# EAGLE design 225_gps (EAGLE 9.6.2)
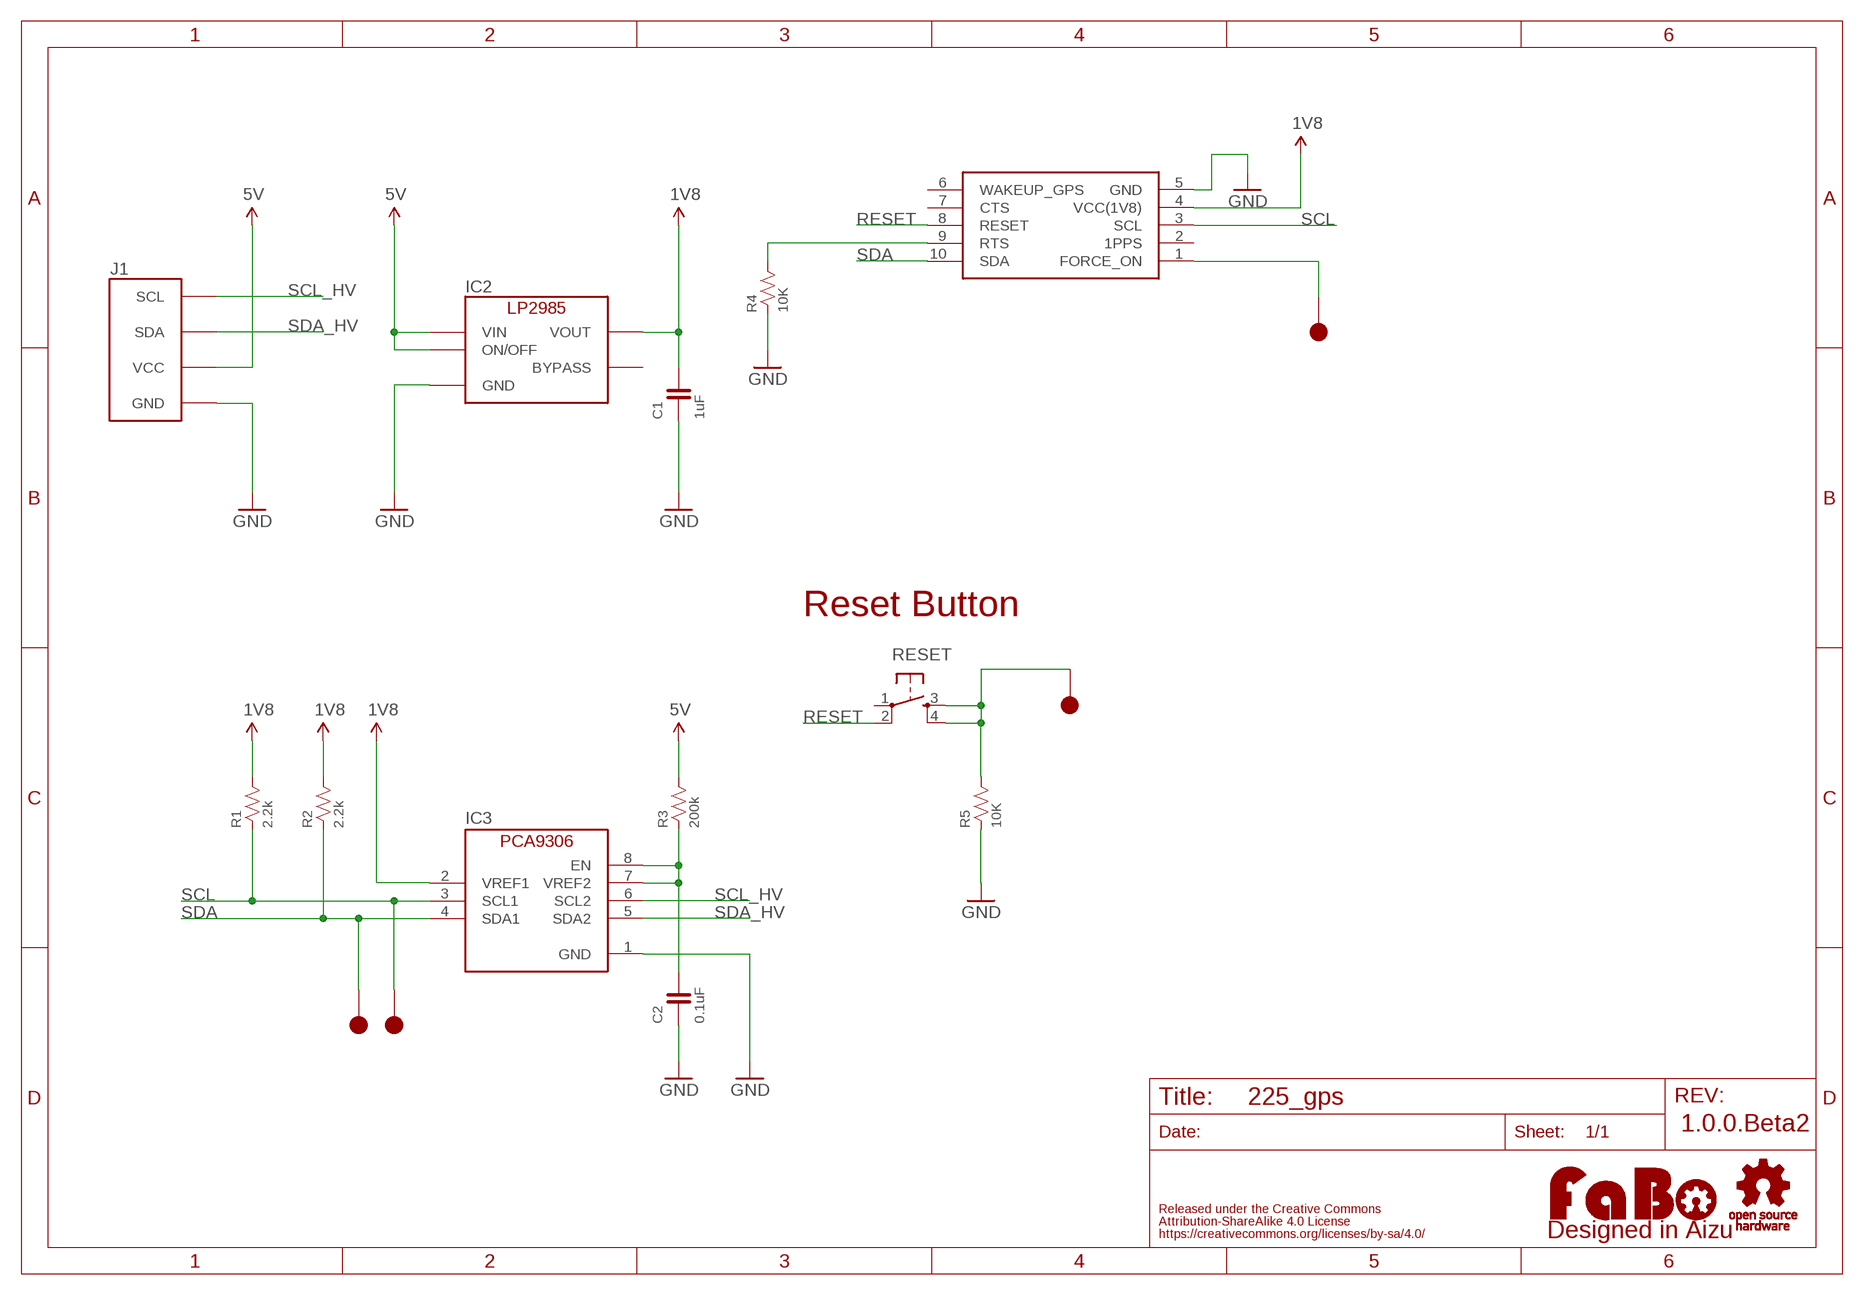
[diagram p0: schematic, sheet 1]

## Parts
C1  1uF  CAPACITOR-0603  [0603]
C2  0.1uF  CAPACITOR-0603  [0603]
IC2  LP2985-33DBV  [SOT-23-5]
IC3  PCA9306GM  [XQFN8]
J1  FABO_BRICK_I2C  [FABO_BRICK_I2C]
LOGO1  LOGO_FABO-M  [LOGO_FABO_M]
R1  2.2k  RESISTOR-0603  [0603]
R2  2.2k  RESISTOR-0603  [0603]
R3  200k  RESISTOR-0603  [0603]
R4  10K  RESISTOR-0603  [0603]
R5  10K  RESISTOR-0603  [0603]
RESET  TACT-SWITCH-SMD_KMR2  [KMR2]
TP1  TP-15  [TP-15]
TP2  TP-15  [TP-15]
TP3  TP-15  [TP-15]
TP4  TP-15  [TP-15]
U$2  LOGO_OSHW-M_BOTTOM  [LOGO_OSHW_M_BOTTOM]
U$4  ORIGINGPS_ORG1510  [ORIGINGPS_ORG1510]

## Nets
1V8: C1.2 IC2.5(VOUT) IC3.2(VREF1) R1.2 R2.2 U$4.4(VCC(1V8))
5V: IC2.1(VIN) IC2.3(ON/OFF) J1.VCC R3.2
GND: C1.1 C2.1 IC2.2(GND) IC3.1(GND) J1.GND R4.1 R5.1 U$4.5(GND)
N$1: C2.2 IC3.7(VREF2) IC3.8(EN) R3.1
N$2: R4.2 U$4.9(RTS)
N$4: TP3.1 U$4.1(FORCE_ON)
N$5: R5.2 RESET.3 RESET.4 TP4.1
RESET: RESET.2 U$4.8(RESET)
SCL: IC3.3(SCL1) R1.1 TP2.1 U$4.3(SCL)
SCL_HV: IC3.6(SCL2) J1.SCL
SDA: IC3.4(SDA1) R2.1 TP1.1 U$4.10(SDA)
SDA_HV: IC3.5(SDA2) J1.SDA
Unconnected: IC2.4(BYPASS) RESET.1 U$4.2(1PPS) U$4.6(WAKEUP_GPS) U$4.7(CTS)

## Notes on the sheet
- Reset Button
- 1.0.0.Beta2

## Library data of the parts
C1 C2 = FaBo-Capacitor:CAPACITOR: CAPACITOR
IC2 = FaBo-Supply:LP2985: LP2985
IC3 = FaBo-LevelTranslator:PCA9306
J1 = FaBo-Template:FABO_BRICK_I2C: FaBo Brick I2C
LOGO1 = component:LOGO_FABO
R1-R5 = FaBo-Resistors:RESISTOR: RESISTOR
RESET = FaBo-Switch:TACT-SWITCH
TP1-TP4 = FaBo-Supply:TP
U$2 = FaBo-etc:LOGO_OSHW
U$4 = FaBo-GPS:ORIGINGPS_ORG1510

## Board
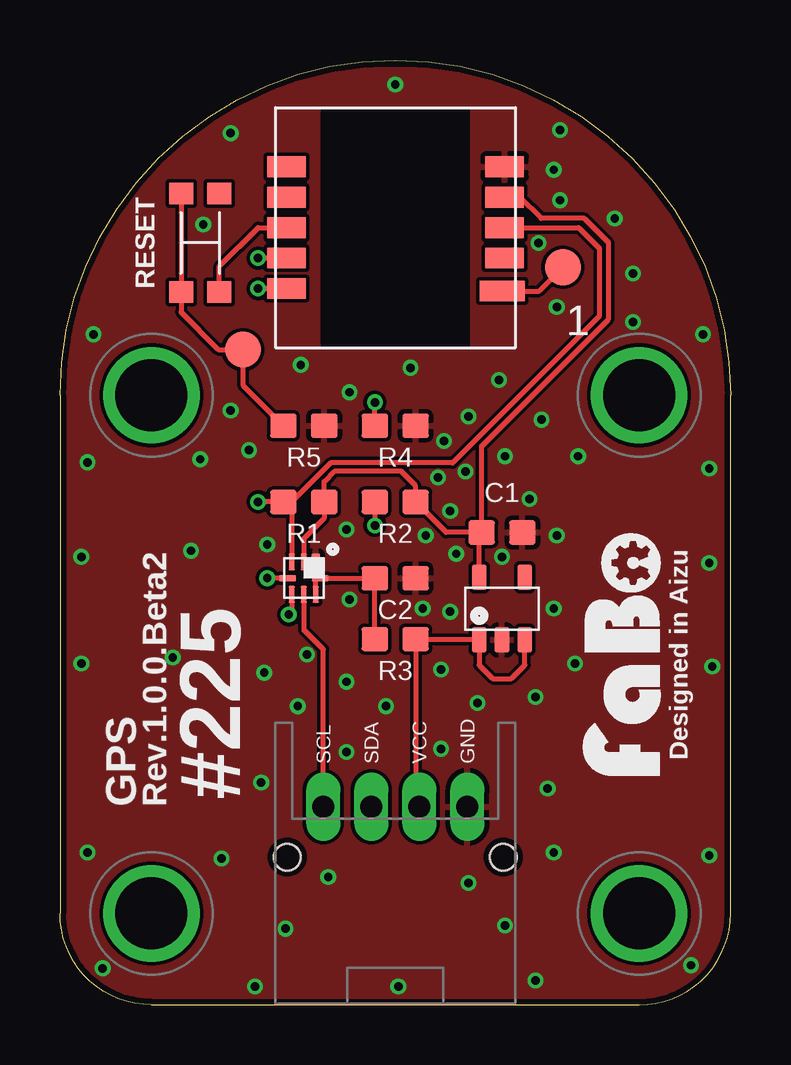
[diagram p1: board, top side]
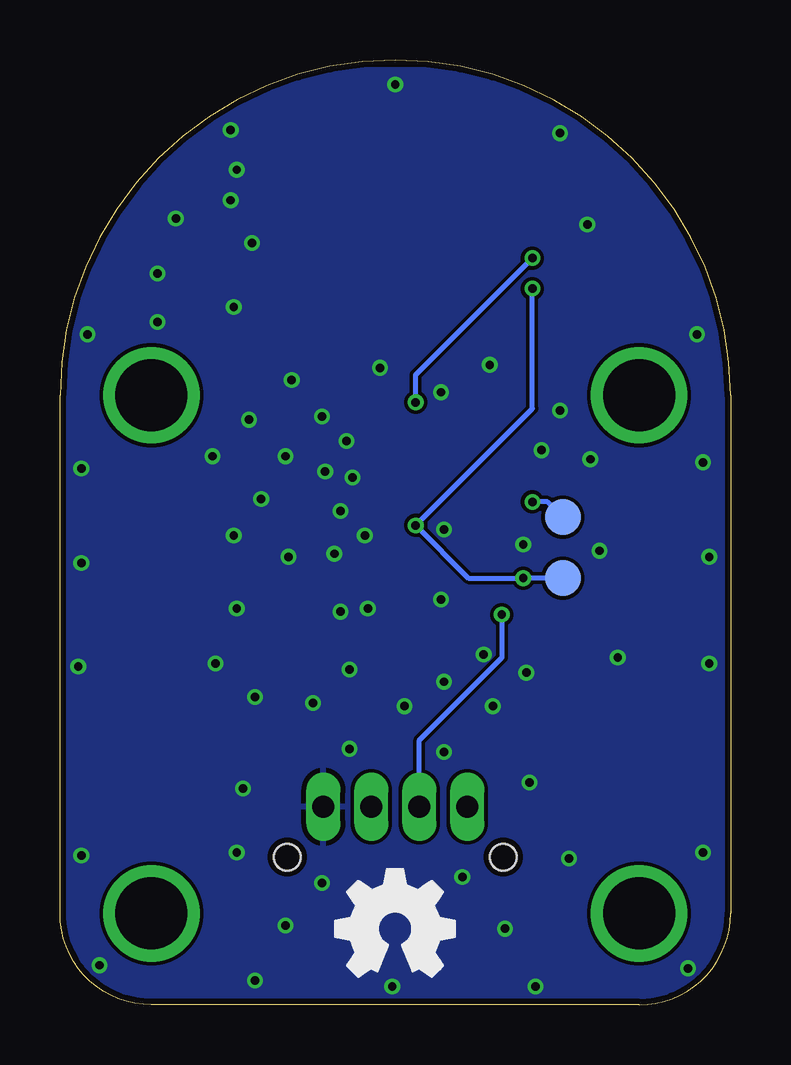
[diagram p2: board, bottom side, seen from below]

Size 27.94 x 39.37 mm. Coordinates in mm from the lower left corner, seen from the top.
Copper layers (1*16): Top 0.035mm / dielectric 1.6mm / Bottom 0.035mm
Design rules "PCBway": minimum track width 6mil, minimum drill 12mil, track to track 6mil, track to pad 6mil, pad to pad 6mil, via to via 6mil, smd to smd 6mil, copper to edge 10mil, drill to drill 10mil, minimum pad ring 10mil, minimum via ring 6mil, stop-mask expansion 2mil, vias tented up to drill 100mil, thermal gap 8mil

### Footprints (pad centres in the part's own frame; a part is rotated, then mirrored left to right if it is on the bottom)
0603 = smd 1.1 x 1: 1 -0.85,0; 2 0.85,0
SOT-23-5 = smd 0.6 x 1.05: 1 -0.95,-1.3; 2 0,-1.3; 3 0.95,-1.3; 4 0.95,1.3; 5 -0.95,1.3
XQFN8 = smd 0.7 x 0.35: 1 -0.675,0.5 | smd 0.7 x 0.25: 2 -0.675,0; 3 -0.675,-0.5; 5 0.675,-0.5; 6 0.675,0; 7 0.675,0.5 | smd 0.25 x 0.7: 4 0,-0.675; 8 0,0.675
FABO_BRICK_I2C = drill 0.9 pad 1.422 long: GND 3,-10.795; SCL -3,-10.795; SDA -1,-10.795; VCC 1,-10.795 | drill 3 pad 3.81: P$1 -10.16,6.35; P$2 10.16,6.35; P$3 -10.16,-15.24; P$4 10.16,-15.24 | hole 1.1: -4.5,-12.895; 4.5,-12.895
KMR2 = smd 0.9 x 1: 1 -2.05,0.8; 2 2.05,0.8; 3 2.05,-0.8; 4 -2.05,-0.8
TP-15 = smd 1.5 x 1.5: 1 0,0
ORIGINGPS_ORG1510 = smd 1.874 x 0.864: 1 4.454,-2.64 | smd 1.6 x 0.864: 2 4.554,-1.27; 3 4.554,0; 4 4.554,1.27; 5 4.554,2.54; 6 -4.536,2.54; 7 -4.536,1.27; 8 -4.536,0; 9 -4.536,-1.27; 10 -4.536,-2.54

### Placement (x,y rotation side)
C1  18.41,19.68 180 top
C2  13.97,17.78 180 top
IC2  18.41,16.51 0 top
IC3  10.16,17.78 270 top
J1  13.97,19.05 0 top
LOGO1  25.4,14.61 90 top
R1  10.16,20.95 0 top
R2  13.97,20.95 0 top
R3  13.97,15.24 0 top
R4  13.97,24.13 180 top
R5  10.16,24.13 180 top
RESET  5.84,31.75 270 top
TP1  6.99,17.78 0 bottom
TP2  6.99,20.32 0 bottom
TP3  20.95,30.73 0 top
TP4  7.62,27.3 0 top
U$2  13.97,3.17 0 top
U$4  13.97,32.38 0 top

### Tracks (layer width: path | path; a pad name or v marks a point on that pad's centre or on a via)
1V8
  Top 0.203: U$4.4 19.16,33.66 20.05,32.77 21.84,32.77 22.86,31.75 22.86,28.57 17.57,23.28 C1.2 | IC3.2 10.16,19.43 11.01,20.28 R1.2 11.01,21.8 11.43,22.23 14.22,22.23 14.82,21.63 R2.2 16.09,19.68 C1.2 | IC2.5 17.46,19.59 C1.2
5V
  Top 0.203: J1.VCC 14.82,8.4 R3.2 17.43,15.24 IC2.1 17.46,14.16 18.03,13.59 18.8,13.59 19.36,14.16 IC2.3
GND  (via drill 0.35)
  other vias: 19.94,31.75 10.29,14.61 12.06,16.89 16.26,20.57 16.89,22.23 15.75,21.97 16,23.5 11.94,19.81 15.24,19.56 16.51,18.8 18.41,18.67 15.11,16.51 16.26,16.38 20.57,16.51 20.7,19.56 19.56,21.08 18.54,22.86 17.02,24.51 18.29,26.04 20.07,24.38 20.7,29.08 23.88,28.45 23.88,30.48 23.11,32.77 20.83,33.53 20.57,34.8 13.97,38.35 7.11,36.32 20.83,36.45 26.8,27.94 1.4,27.94 5.97,32.51 10.03,26.67 14.61,26.54 7.11,24.77 1.14,22.61 27.05,22.35 7.87,23.11 21.59,22.86 5.84,22.73 8.64,19.18 5.46,18.92 0.89,18.67 27.05,18.41 21.46,14.22 27.18,14.1 0.89,14.22 4.7,14.48 8.51,13.84 9.91,12.45 11.94,13.46 15.88,13.97 19.81,12.83 12.06,25.53 1.14,6.35 27.05,6.22 20.57,6.35 6.73,6.1 1.78,1.52 26.29,1.65 14.1,0.76 8.13,0.76 19.81,1.02 17.02,5.08 11.18,5.33 8.38,9.27 20.32,9.02 15.88,10.67 17.4,12.57 13.59,12.45 11.94,10.54 9.4,3.17 18.54,3.3
  pour Bottom: 0,0 28,0 28,39 0,39
  pour Top: 0,0 28,0 28,39 0,39
N$1
  Top 0.203: R3.1 C2.2 IC3.8 10.66,17.78 IC3.7
N$2  (via drill 0.35)
  Top 0.203: R4.2 v13.12,25.11 | U$4.9 v8.26,31.11
  Bottom 0.203: v13.12,25.11 13.12,26.25 v8.26,31.11
N$4
  Top 0.203: U$4.1 19.97,29.75 TP3.1
N$5
  Top 0.203: RESET.4 RESET.3 5.04,28.87 6.6,27.3 TP4.1 7.62,25.82 R5.2
RESET
  Top 0.203: U$4.8 8.26,32.38 6.64,30.77 RESET.2
SCL  (via drill 0.35)
  Top 0.203: R1.1 9.66,20.61 IC3.3 | R1.1 9.66,20.95 11.28,22.58 16.36,22.58 22.47,28.68 22.47,31.53 21.61,32.38 U$4.3 | R1.1 v8.26,20.95
  Bottom 0.203: TP2.1 7.62,20.95 v8.26,20.95
SCL_HV
  Top 0.203: IC3.6 10.16,15.62 10.97,14.81 J1.SCL
SDA  (via drill 0.35)
  Top 0.203: IC3.4 v8.64,17.78 | R2.1 v13.12,19.98 | U$4.10 v8.26,29.84
  Bottom 0.203: TP1.1 v8.64,17.78 10.92,17.78 v13.12,19.98 8.26,24.84 v8.26,29.84
SDA_HV  (via drill 0.35)
  Top 0.203: IC3.5 9.66,16.39 v9.53,16.26
  Bottom 0.203: v9.53,16.26 9.53,14.47 12.97,11.03 J1.SDA

### Text on the board
tPlace: Designed in Aizu | #225 | GPS | Rev.1.0.0.Beta2